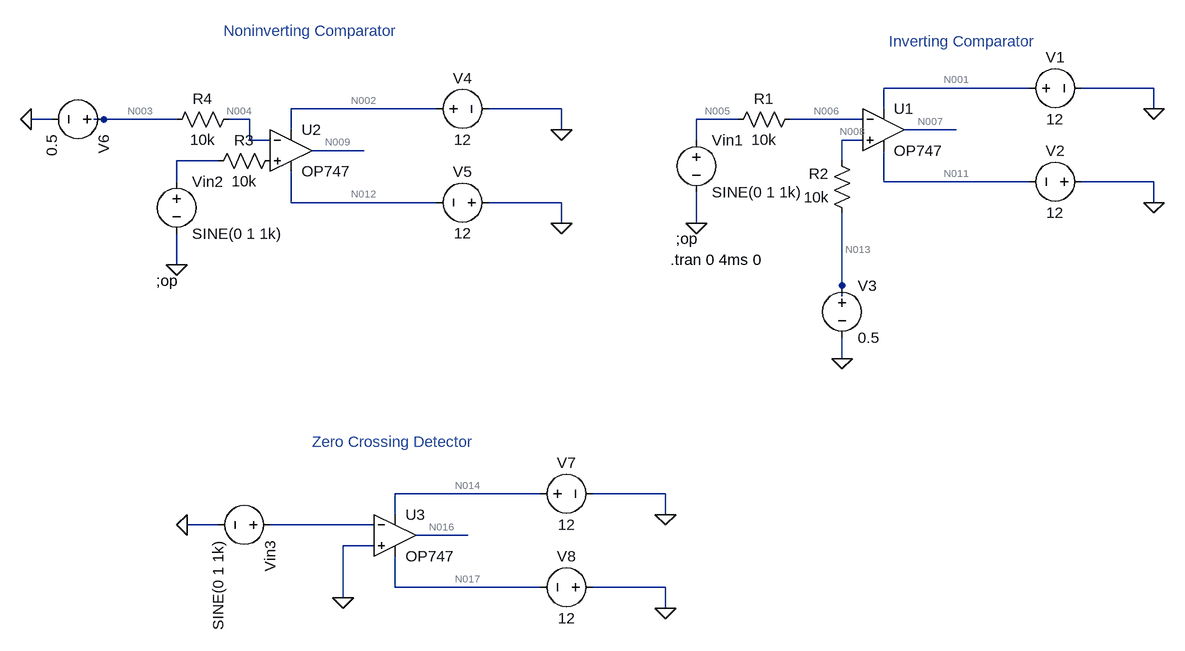
[diagram p0: schematic Comparator.asc]
Comparator.asc, the LTspice schematic file:
Version 4
SHEET 1 880 992
WIRE 384 144 160 144
WIRE 576 144 464 144
WIRE -528 176 -752 176
WIRE -336 176 -448 176
WIRE 160 176 160 144
WIRE 576 176 576 144
WIRE -1120 192 -1152 192
WIRE -1040 192 -1056 192
WIRE -928 192 -1040 192
WIRE -816 192 -848 192
WIRE -64 192 -128 192
WIRE 128 192 16 192
WIRE -752 208 -752 176
WIRE -336 208 -336 176
WIRE 272 208 192 208
WIRE -816 224 -816 192
WIRE -784 224 -816 224
WIRE -128 224 -128 192
WIRE 128 224 96 224
WIRE -640 240 -720 240
WIRE -864 256 -928 256
WIRE 96 256 96 224
WIRE -928 288 -928 256
WIRE 160 288 160 240
WIRE 384 288 160 288
WIRE 576 288 464 288
WIRE -752 320 -752 272
WIRE -528 320 -752 320
WIRE -336 320 -448 320
WIRE 576 320 576 288
WIRE -336 352 -336 320
WIRE -128 352 -128 304
WIRE -928 416 -928 368
WIRE 96 448 96 336
WIRE 96 464 96 448
WIRE 96 560 96 528
WIRE -368 768 -592 768
WIRE -176 768 -288 768
WIRE -592 800 -592 768
WIRE -176 800 -176 768
WIRE -864 816 -912 816
WIRE -624 816 -784 816
WIRE -480 832 -560 832
WIRE -624 848 -672 848
WIRE -592 912 -592 864
WIRE -368 912 -592 912
WIRE -176 912 -288 912
WIRE -672 928 -672 848
WIRE -176 944 -176 912
FLAG -128 352 0
FLAG 576 176 0
FLAG 576 320 0
FLAG 96 560 0
FLAG -336 208 0
FLAG -336 352 0
FLAG -928 416 0
FLAG -1152 192 0
FLAG -912 816 0
FLAG -672 928 0
FLAG -176 800 0
FLAG -176 944 0
SYMBOL voltage 368 144 R270
WINDOW 0 32 56 VTop 2
WINDOW 3 -32 56 VBottom 2
WINDOW 123 0 0 Left 0
WINDOW 39 0 0 Left 0
SYMATTR InstName V1
SYMATTR Value 12
SYMBOL voltage 480 288 R90
WINDOW 0 -32 56 VBottom 2
WINDOW 3 32 56 VTop 2
WINDOW 123 0 0 Left 0
WINDOW 39 0 0 Left 0
SYMATTR InstName V2
SYMATTR Value 12
SYMBOL res 32 176 R90
WINDOW 0 0 56 VBottom 2
WINDOW 3 32 56 VTop 2
SYMATTR InstName R1
SYMATTR Value 10k
SYMBOL res 112 352 R180
WINDOW 0 36 76 Left 2
WINDOW 3 36 40 Left 2
SYMATTR InstName R2
SYMATTR Value 10k
SYMBOL OpAmps\\OP747 160 144 R0
SYMATTR InstName U1
SYMBOL voltage -128 208 R0
WINDOW 123 0 0 Left 0
WINDOW 39 0 0 Left 0
SYMATTR InstName Vin1
SYMATTR Value SINE(0 1 1k)
SYMBOL voltage 96 432 R0
WINDOW 123 0 0 Left 0
WINDOW 39 0 0 Left 0
SYMATTR InstName V3
SYMATTR Value 0.5
SYMBOL voltage -544 176 R270
WINDOW 0 32 56 VTop 2
WINDOW 3 -32 56 VBottom 2
WINDOW 123 0 0 Left 0
WINDOW 39 0 0 Left 0
SYMATTR InstName V4
SYMATTR Value 12
SYMBOL voltage -432 320 R90
WINDOW 0 -32 56 VBottom 2
WINDOW 3 32 56 VTop 2
WINDOW 123 0 0 Left 0
WINDOW 39 0 0 Left 0
SYMATTR InstName V5
SYMATTR Value 12
SYMBOL OpAmps\\OP747 -752 176 R0
SYMATTR InstName U2
SYMBOL res -768 240 R90
WINDOW 0 0 56 VBottom 2
WINDOW 3 32 56 VTop 2
SYMATTR InstName R3
SYMATTR Value 10k
SYMBOL voltage -928 272 R0
WINDOW 123 0 0 Left 0
WINDOW 39 0 0 Left 0
SYMATTR InstName Vin2
SYMATTR Value SINE(0 1 1k)
SYMBOL res -944 208 R270
WINDOW 0 32 56 VTop 2
WINDOW 3 0 56 VBottom 2
SYMATTR InstName R4
SYMATTR Value 10k
SYMBOL voltage -1024 192 R90
WINDOW 123 0 0 Left 0
WINDOW 39 0 0 Left 0
SYMATTR InstName V6
SYMATTR Value 0.5
SYMBOL voltage -768 816 R90
WINDOW 123 0 0 Left 0
WINDOW 39 0 0 Left 0
SYMATTR InstName Vin3
SYMATTR Value SINE(0 1 1k)
SYMBOL voltage -384 768 R270
WINDOW 0 32 56 VTop 2
WINDOW 3 -32 56 VBottom 2
WINDOW 123 0 0 Left 0
WINDOW 39 0 0 Left 0
SYMATTR InstName V7
SYMATTR Value 12
SYMBOL voltage -272 912 R90
WINDOW 0 -32 56 VBottom 2
WINDOW 3 32 56 VTop 2
WINDOW 123 0 0 Left 0
WINDOW 39 0 0 Left 0
SYMATTR InstName V8
SYMATTR Value 12
SYMBOL OpAmps\\OP747 -592 768 R0
SYMATTR InstName U3
TEXT -160 376 Left 2 !;op
TEXT -168 408 Left 2 !.tran 0 4ms 0
TEXT 168 72 Left 2 ;Inverting Comparator
TEXT -856 56 Left 2 ;Noninverting Comparator
TEXT -960 440 Left 2 !;op
TEXT -720 688 Left 2 ;Zero Crossing Detector

The netlist it stands for:
* Comparator.asc
V1 N001 0 12
V2 0 N011 12
R1 N006 N005 10k
R2 N013 N008 10k
XU1 N008 N006 N001 N011 N007 OP747  ; pins In+ In- V+ V- OUT
Vin1 N005 0 SINE(0 1 1k)
V3 N013 0 0.5
V4 N002 0 12
V5 0 N012 12
XU2 P001 N004 N002 N012 N009 OP747  ; pins In+ In- V+ V- OUT
R3 P001 N010 10k
Vin2 N010 0 SINE(0 1 1k)
R4 N003 N004 10k
V6 N003 0 0.5
Vin3 N015 0 SINE(0 1 1k)
V7 N014 0 12
V8 0 N017 12
XU3 0 N015 N014 N017 N016 OP747  ; pins In+ In- V+ V- OUT
;op
.tran 0 4ms 0
* Inverting Comparator
* Noninverting Comparator
;op
* Zero Crossing Detector
.backanno
.end

* Results of the author's LTspice run, read from the files saved beside the schematic
* Operating Point, zero values left out:
*   V(n001) = 12 V
*   V(n011) = -12 V
*   V(n006) = 191.8 µV
*   V(n013) = 500 mV
*   V(n008) = 500 mV
*   V(n007) = 12 V
*   V(n002) = 12 V
*   V(n012) = -12 V
*   V(n004) = 500 mV
*   V(p001) = 211.8 µV
*   V(n009) = -12 V
*   V(n003) = 500 mV
*   V(n014) = 12 V
*   V(n017) = -12 V
*   V(n016) = 12 V
*   I(R1) = 19.18 nA
*   I(R2) = -987.6 pA
*   I(R3) = 21.18 nA
*   I(R4) = 1.012 nA
*   I(V1) = -112.4 µA
*   I(V2) = -112.4 µA
*   I(Vin1) = 19.18 nA
*   I(V3) = 987.6 pA
*   I(V4) = -112.4 µA
*   I(V5) = -112.4 µA
*   I(Vin2) = 21.18 nA
*   I(V6) = -1.012 nA
*   I(Vin3) = 9.084 nA
*   I(V7) = -112.4 µA
*   I(V8) = -112.4 µA
*   Ix(u1:1) = -987.6 pA
*   Ix(u1:2) = -19.18 nA
*   Ix(u1:99) = 112.4 µA
*   Ix(u1:50) = -112.4 µA
*   Ix(u2:1) = -21.18 nA
*   Ix(u2:2) = 1.012 nA
*   Ix(u2:99) = 112.4 µA
*   Ix(u2:50) = -112.4 µA
*   Ix(u3:1) = -11.05 nA
*   Ix(u3:2) = -9.084 nA
*   Ix(u3:99) = 112.4 µA
*   Ix(u3:50) = -112.4 µA
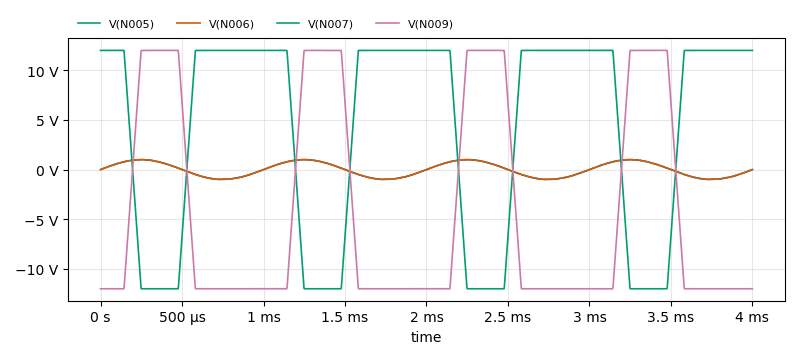
[diagram p1: Transient Analysis of Comparator.asc, plotted from the saved traces]
* Transient Analysis, 1 run:
*   V(N005): min -985.6 mV, max 1 V, average 2.048 mV, rms 704.6 mV, last 0 V
*   V(N006): min -985.2 mV, max 1 V, average 2.176 mV, rms 704.4 mV, last 191.8 µV
*   V(N007): min -12 V, max 12 V, average 4.008 V, rms 11.15 V, last 12 V
*   V(N009): min -12 V, max 12 V, average -4.006 V, rms 11.15 V, last -12 V